# EAGLE schematic ESP32-H2-MINI-1U-passend (EAGLE 9.6.2)
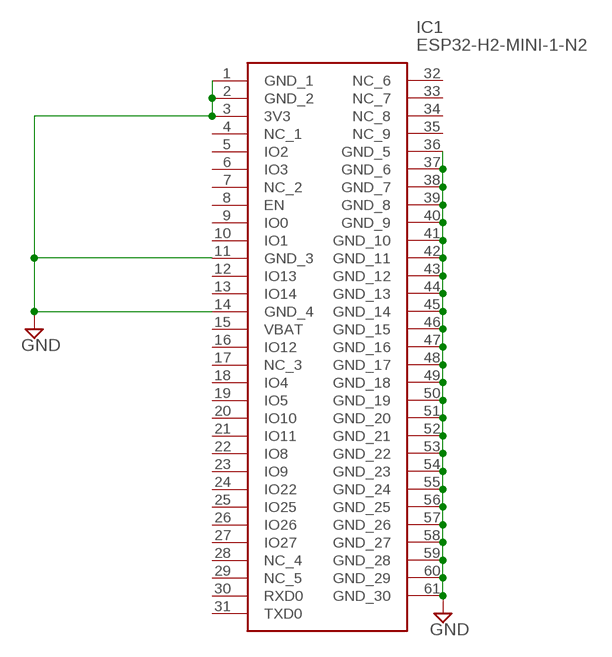
[diagram p0: schematic, sheet 1]

## Parts
IC1  ESP32-H2-MINI-1-N2  [ESP32H2MINI1N2]

## Nets
GND: IC1.1(GND_1) IC1.2(GND_2) IC1.3(3V3) IC1.11(GND_3) IC1.14(GND_4) IC1.36(GND_5) IC1.37(GND_6) IC1.38(GND_7) IC1.39(GND_8) IC1.40(GND_9) IC1.41(GND_10) IC1.42(GND_11) IC1.43(GND_12) IC1.44(GND_13) IC1.45(GND_14) IC1.46(GND_15) IC1.47(GND_16) IC1.48(GND_17) IC1.49(GND_18) IC1.50(GND_19) IC1.51(GND_20) IC1.52(GND_21) IC1.53(GND_22) IC1.54(GND_23) IC1.55(GND_24) IC1.56(GND_25) IC1.57(GND_26) IC1.58(GND_27) IC1.59(GND_28) IC1.60(GND_29) IC1.61(GND_30)
Unconnected: IC1.4(NC_1) IC1.5(IO2) IC1.6(IO3) IC1.7(NC_2) IC1.8(EN) IC1.9(IO0) IC1.10(IO1) IC1.12(IO13) IC1.13(IO14) IC1.15(VBAT) IC1.16(IO12) IC1.17(NC_3) IC1.18(IO4) IC1.19(IO5) IC1.20(IO10) IC1.21(IO11) IC1.22(IO8) IC1.23(IO9) IC1.24(IO22) IC1.25(IO25) IC1.26(IO26) IC1.27(IO27) IC1.28(NC_4) IC1.29(NC_5) IC1.30(RXD0) IC1.31(TXD0) IC1.32(NC_6) IC1.33(NC_7) IC1.34(NC_8) IC1.35(NC_9)

## Library data of the parts
IC1 = ESP32-H2-MINI-1U-passend:ESP32-H2-MINI-1-N2: Multiprotocol Modules ENGINEERING SAMPLE Bluetooth Low Energy and IEEE 802.15.4 module with ESP32-H2 chip Source: Datasheet <https://www.espressif.com/sites/default/files/documentation/esp32-h2-mini-1_mini-1u_datasheet_en.pdf>; DESCRIPTION: Multiprotocol Modules ENGINEERING SAMPLE Bluetooth Low Energy and IEEE 802.15.4 module with ESP32-H2 chip; HEIGHT: 2.55mm; MANUFACTURER_NAME: Espressif Systems; MANUFACTURER_PART_NUMBER: ESP32-H2-MINI-1-N2; MOUSER_PART_NUMBER: 356-ESP32H2MINI1-N2; MOUSER_PRICE-STOCK: https://www.mouser.co.uk/ProductDetail/Espressif-Systems/ESP32-H2-MINI-1-N2?qs=Jm2GQyTW%2FbhDEK4sfiNMsw%3D%3D